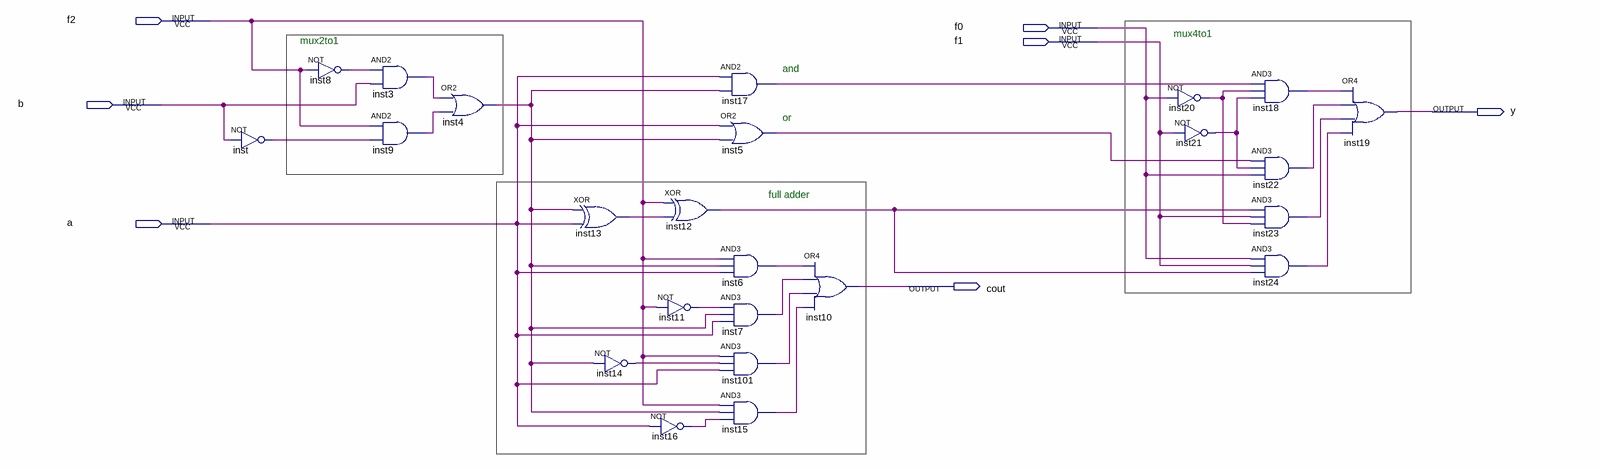
[diagram p0: schematic sheet]
// Quartus schematic alu8bits.bdf as structural Verilog: 24 symbols, 7 pins
module alu8bits (
  input  f2,
  input  f0,
  input  f1,
  input  b,
  input  a,
  output y,
  output cout
);

  wire inst3_out, inst4_out, inst5_out, inst6_out, inst7_out, inst8_out, inst9_out, inst11_out, inst12_out,
       inst13_out, inst14_out, inst15_out, inst16_out, inst17_out, inst18_out, inst20_out, inst21_out,
       inst22_out, inst23_out, inst24_out, inst101_out, inst_out;

  not inst (inst_out, b);
  not inst8 (inst8_out, f2);
  and inst3 (inst3_out, inst8_out, b);
  and inst9 (inst9_out, f2, inst_out);
  or inst4 (inst4_out, inst3_out, inst9_out);
  xor inst13 (inst13_out, inst4_out, a);
  not inst14 (inst14_out, inst4_out);
  xor inst12 (inst12_out, f2, inst13_out);
  not inst11 (inst11_out, f2);
  not inst16 (inst16_out, a);
  and inst17 (inst17_out, a, inst4_out);
  or inst5 (inst5_out, a, inst4_out);
  and inst6 (inst6_out, f2, inst4_out, a);
  and inst7 (inst7_out, inst11_out, inst4_out, a);
  and inst101 (inst101_out, f2, inst14_out, a);
  and inst15 (inst15_out, f2, inst4_out, inst16_out);
  or inst10 (cout, inst6_out, inst7_out, inst101_out, inst15_out);
  not inst20 (inst20_out, f0);
  not inst21 (inst21_out, f1);
  and inst18 (inst18_out, inst17_out, inst20_out, inst21_out);
  and inst22 (inst22_out, inst5_out, inst21_out, f0);
  and inst23 (inst23_out, inst12_out, f1, inst20_out);
  and inst24 (inst24_out, f0, f1, inst12_out);
  or inst19 (y, inst18_out, inst22_out, inst23_out, inst24_out);

  // Notes on the sheet:
  //   mux4to1
  //   mux2to1
  //   and
  //   or
  //   full adder
endmodule
